# EasyEDA schematic Fume_Absorber.json
TITLE: Wiring Diagram; REV: 1.0; Date: 2026-10-07; Sheet: 1/1; Company: Silicon Labs
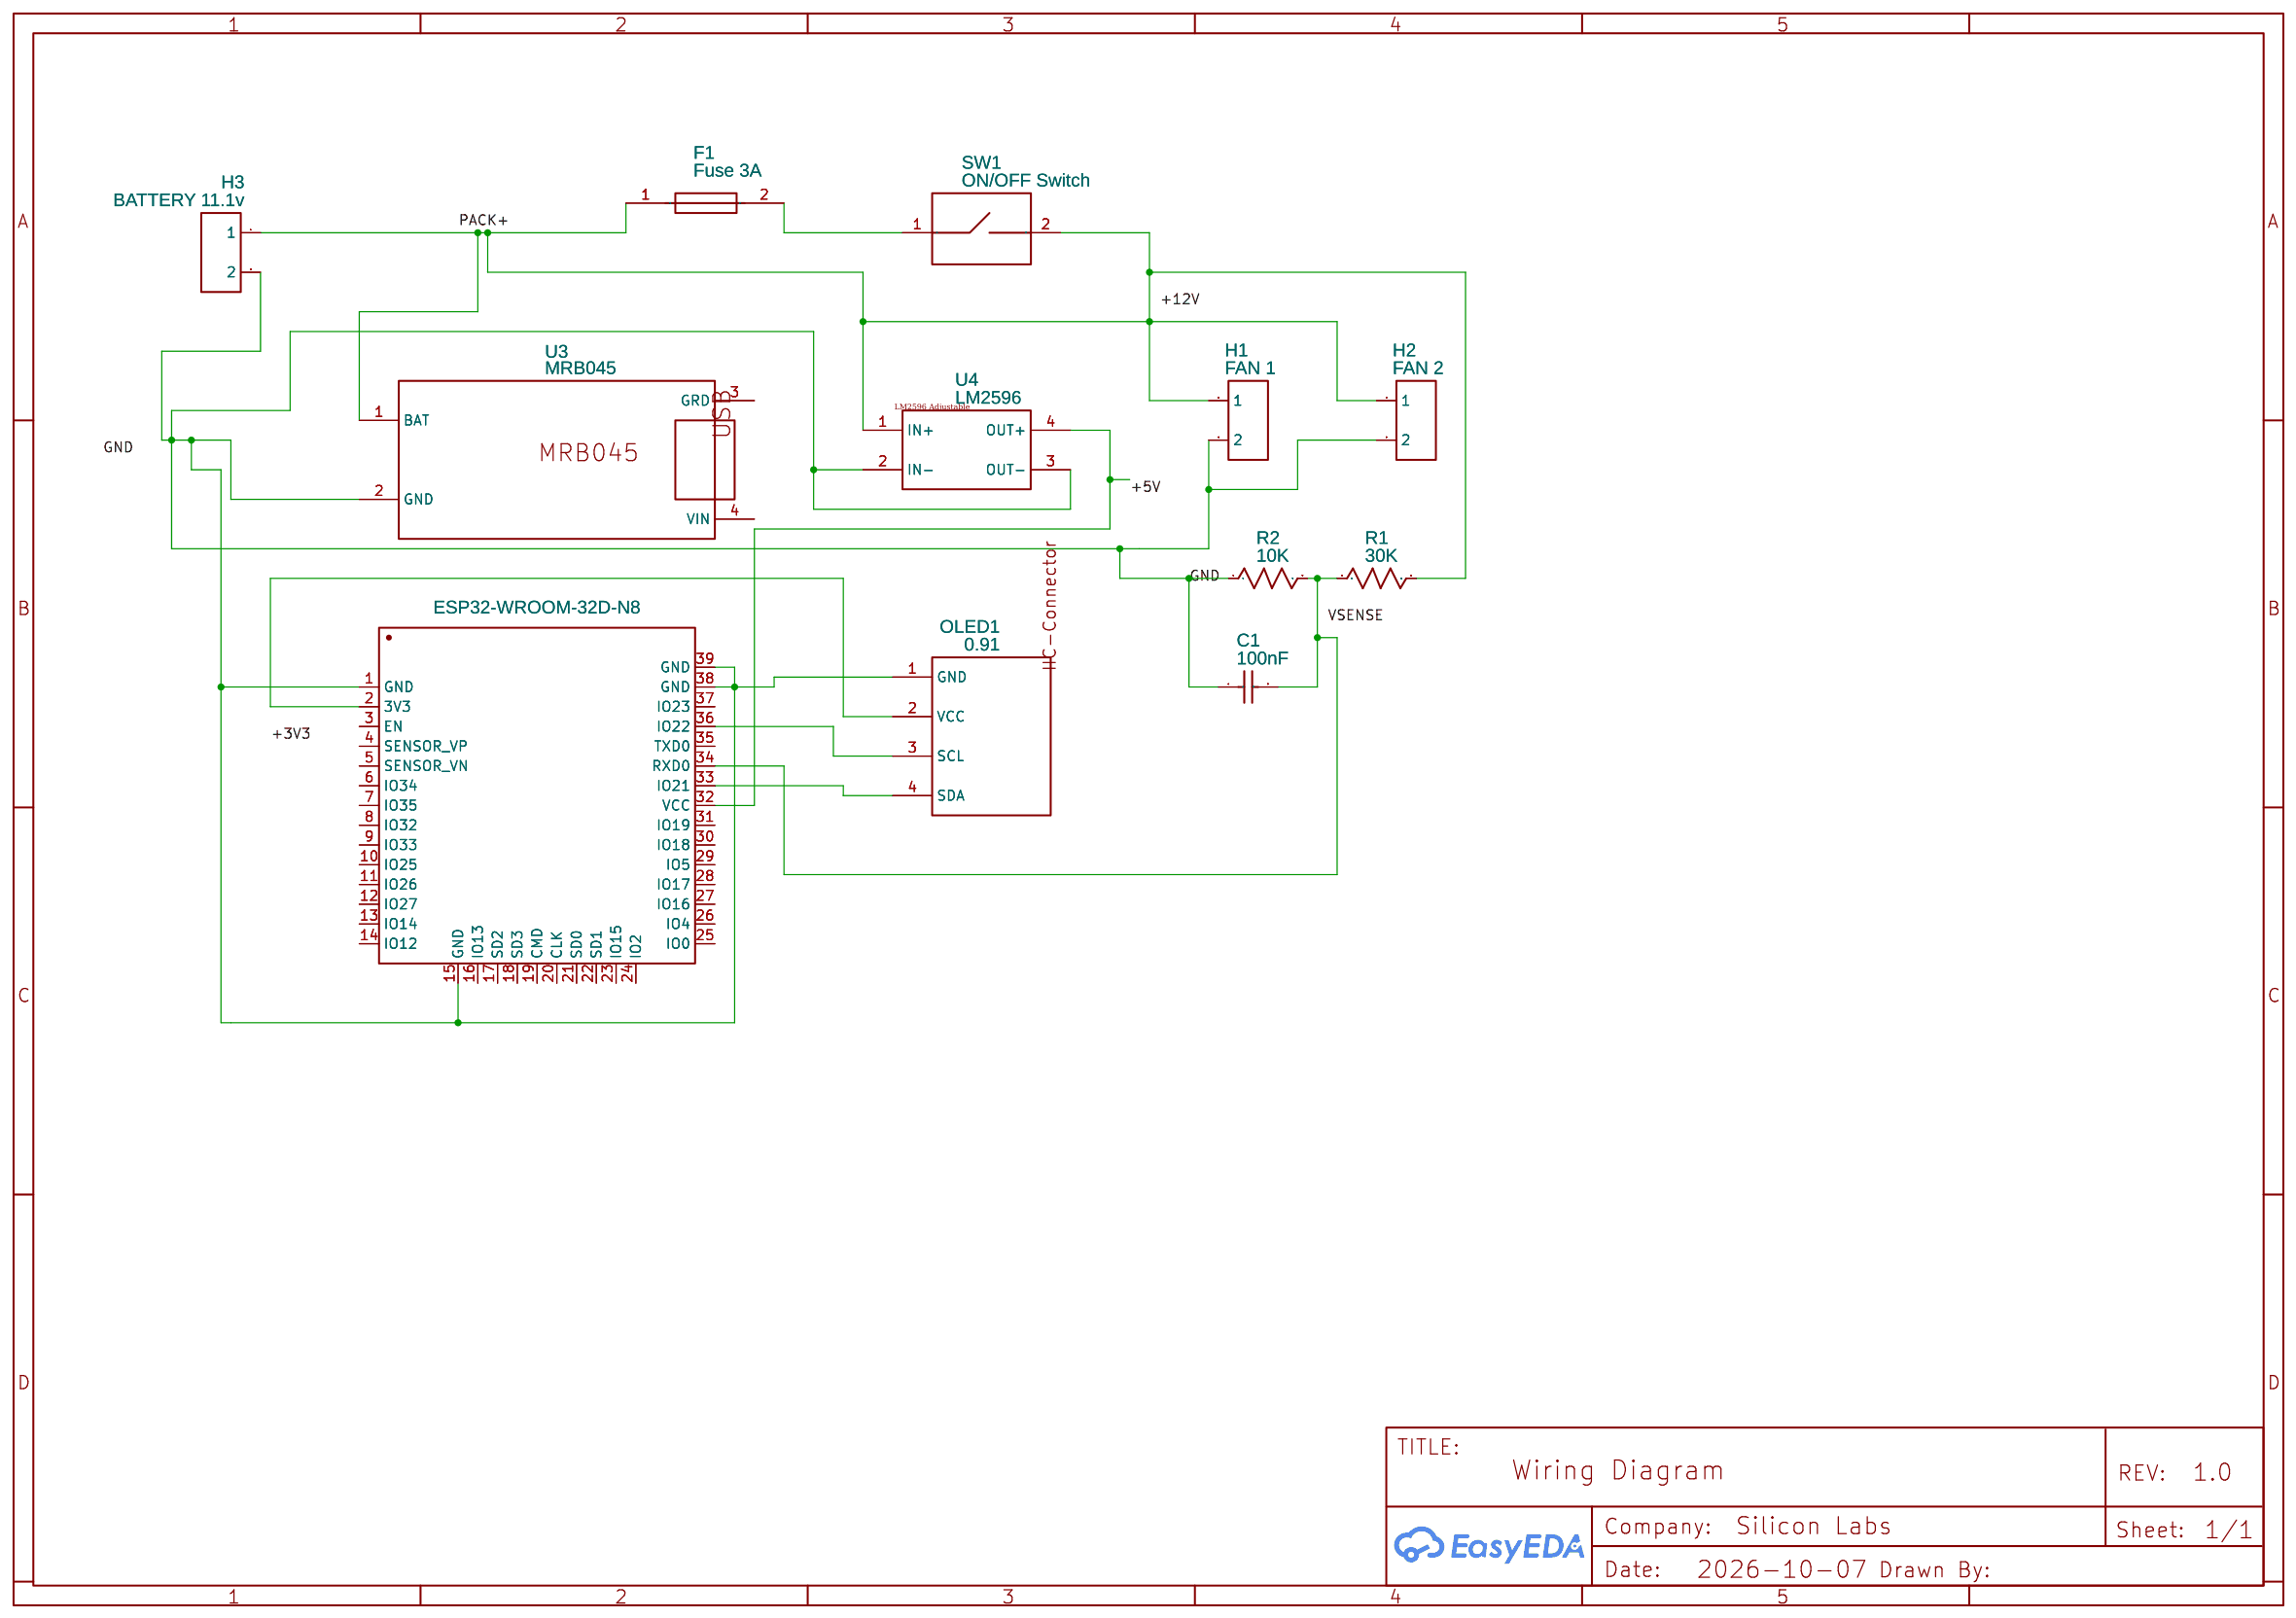
[diagram p0: schematic sheet]

## Parts
C1  100nF  [CAP-TH_L7.2-W3.5-P5.00-D0.5]
F1  Fuse 3A  [FUSE-TH_AUTO-FUSE-3A]
H1  FAN 1  [HDR-TH_2P-P2.54-V-M-1]
H2  FAN 2  [HDR-TH_2P-P2.54-V-M-1]
H3  BATTERY 11.1v  [HDR-TH_2P-P2.54-V-M-1]
OLED1  0.91  [0.96OLED_4P]
R1  30K  [R0603]
R2  10K  [R0603]
SW1  ON/OFF Switch  [SW-TH_MTS-101]
U1  ESP32-WROOM-32D-N8  [WIFIM-SMD_ESP32-WROOM-32D]
U3  MRB045  [MRB045]
U4  LM2596  [LM2596:YAAJ_DCDC_STEPDOWN_LM2596]

## Library data of the parts
C1 = Calibration capacitor100nF（104）100V,5%: Supplier: LCSC; Manufacturer: ReliaPro; Supplier Part: C26609
F1 = 汽车中号保险丝座: Contributor: lcsc; Supplier: LCSC; Supplier Part: C9900014676; Manufacturer: null; JLCPCB Part Class: Extended Part
H1-H3 = Header-Male-2.54_1x2: Supplier: LCSC; Manufacturer: TE Connectivity(泰科电子); Manufacturer Part: 826629-2; Supplier Part: C86471; JLCPCB Part Class: Extended Part
OLED1 = 0.96OLED_4P_MODULE_JX: Contributor: LCSC; Supplier: LCSC; Supplier Part: C9900004566; Manufacturer: null; JLCPCB Part Class: Extended Part
R1 R2 = R_0603_US: Contributor: LCEDA_Lib
SW1 = PU-MTS-101 ON-OFF: Supplier: LCSC; Supplier Part: C9900183724; Manufacturer: null; Manufacturer Part: pu-mts-101 ON-OFF; Contributor: lcsc; JLCPCB Part Class: Extended Part
U1 = ESP32-WROOM-32D-N8: Contributor: lcsc; Supplier: LCSC; Supplier Part: C2973677; Manufacturer: null; Manufacturer Part: ESP32-WROOM-32D-N8-被合并; JLCPCB Part Class: Extended Part
U3 = MRB045: Contributor: pasknet
U4 = BuckConverters_LM2596_Adj_PAD: Servo 5V; Symbol: BuckConverters_LM2596_Adj; Device: BuckConverters_LM2596_Adj; Add into BOM: yes; Convert to PCB: yes; Origin Footprint: YAAJ_DCDC_StepDown_LM2596; Comment: BuckConverters_LM2596_Adj; Contributor: razeed

## Nets
GND: C1.1 H1.2 H2.2 H3.2 OLED1.1(GND) R2.1 U1.1(GND) U1.15(GND) U1.38(GND) U1.39(GND) U3.2(GND) U4.2(IN-) U4.3(OUT-)
Net-(C1-2): C1.2 R1.1 R2.2 U1.34(RXD0)
Net-(F1-1): F1.1 H1.1 H2.1 H3.1 R1.2 SW1.2 U3.1(BAT) U4.1(IN+)
Net-(F1-2): F1.2 SW1.1
Net-(OLED1-2): OLED1.2(VCC) U1.2(3V3)
Net-(OLED1-3): OLED1.3(SCL) U1.36(IO22)
Net-(OLED1-4): OLED1.4(SDA) U1.33(IO21)
Net-(U1-32): U1.32(VCC) U4.4(OUT+)

Not connected (* = marked no-connect by the designer): U1 3(EN) 4(SENSOR_VP) 5(SENSOR_VN) 6(IO34) 7(IO35) 8(IO32) 9(IO33) 10(IO25) 11(IO26) 12(IO27) 13(IO14) 14(IO12) 16(IO13) 17(SD2) 18(SD3) 19(CMD) 20(CLK) 21(SD0) 22(SD1) 23(IO15) 24(IO2) 25(IO0) 26(IO4) 27(IO16) 28(IO17) 29(IO5) 30(IO18) 31(IO19) 35(TXD0) 37(IO23); U3 3(GRD) 4(VIN)
